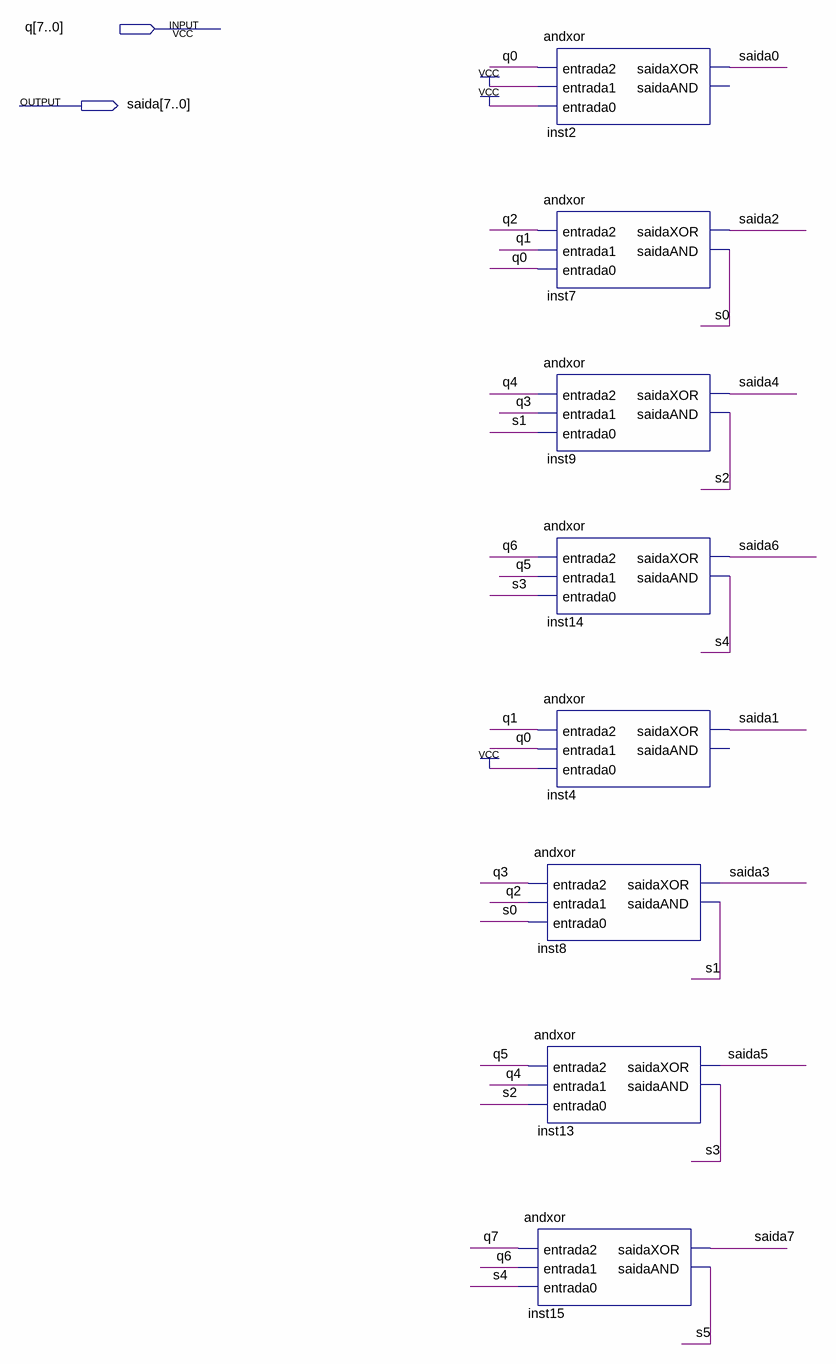
[diagram p0: schematic sheet]
// Quartus schematic pc_up.bdf as structural Verilog: 8 symbols, 2 pins
module pc_up (
  input  [7:0] q,
  output [7:0] saida
);

  wire s0, s1, s2, s3, s4, s5;

  andxor inst2 (.entrada2(q[0]), .entrada1(1'b1), .entrada0(1'b1), .saidaXOR(saida[0]));  // open: saidaAND
  andxor inst7 (.entrada2(q[2]), .entrada1(q[1]), .entrada0(q[0]), .saidaXOR(saida[2]), .saidaAND(s0));
  andxor inst9 (.entrada2(q[4]), .entrada1(q[3]), .entrada0(s1), .saidaXOR(saida[4]), .saidaAND(s2));
  andxor inst14 (.entrada2(q[6]), .entrada1(q[5]), .entrada0(s3), .saidaXOR(saida[6]), .saidaAND(s4));
  andxor inst4 (.entrada2(q[1]), .entrada1(q[0]), .entrada0(1'b1), .saidaXOR(saida[1]));  // open: saidaAND
  andxor inst8 (.entrada2(q[3]), .entrada1(q[2]), .entrada0(s0), .saidaXOR(saida[3]), .saidaAND(s1));
  andxor inst13 (.entrada2(q[5]), .entrada1(q[4]), .entrada0(s2), .saidaXOR(saida[5]), .saidaAND(s3));
  andxor inst15 (.entrada2(q[7]), .entrada1(q[6]), .entrada0(s4), .saidaXOR(saida[7]), .saidaAND(s5));
endmodule
